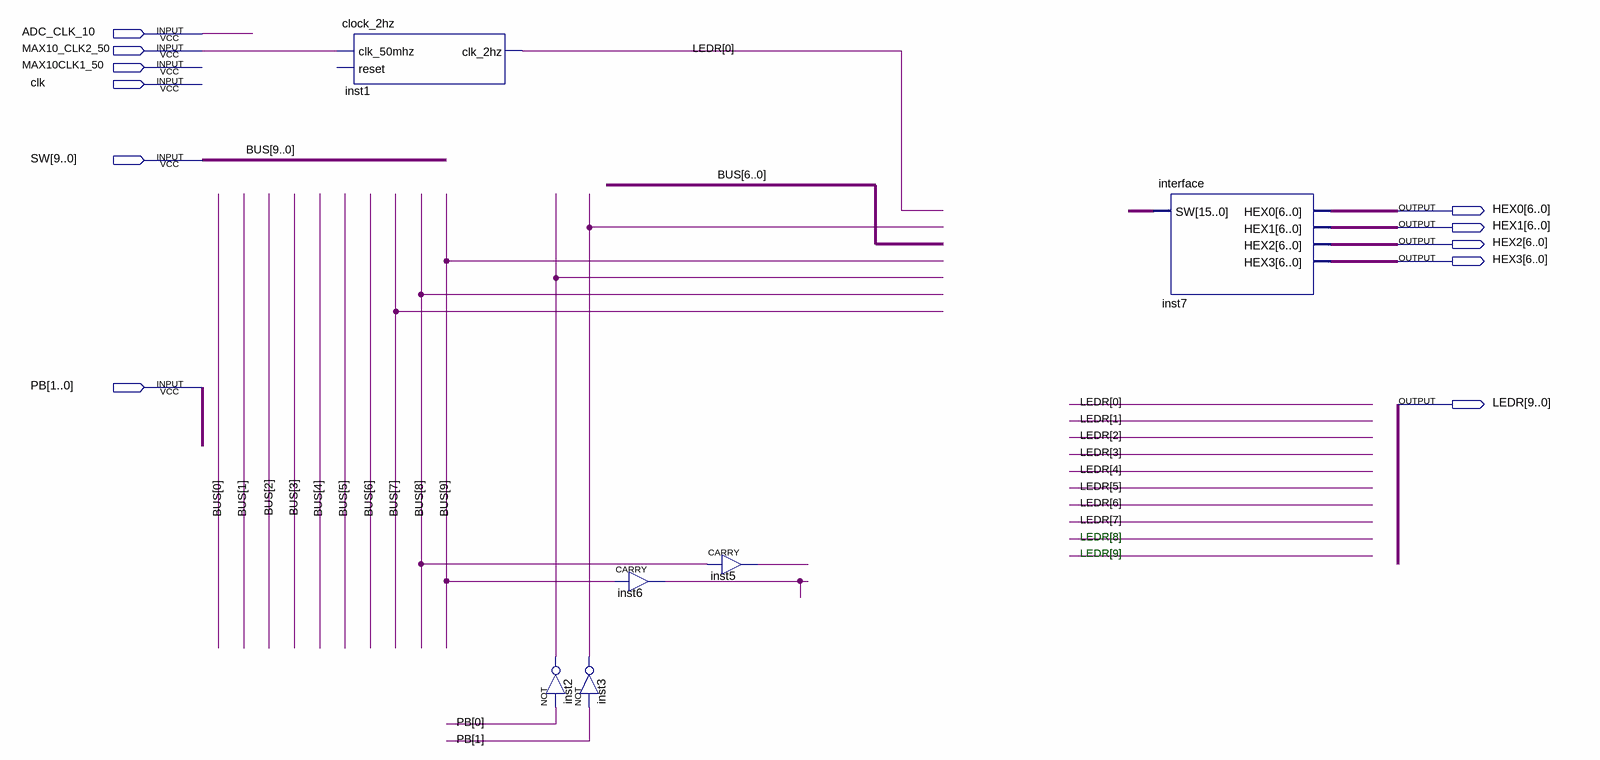
[diagram p0: schematic sheet]
// Quartus schematic testing.bdf as structural Verilog: 6 symbols, 11 pins
module testing (
  input  ADC_CLK_10,
  input  MAX10_CLK2_50,
  input  MAX10CLK1_50,
  input  clk,
  input  [9:0] SW,
  input  [1:0] PB,
  output [6:0] HEX0,
  output [6:0] HEX1,
  output [6:0] HEX2,
  output [6:0] HEX3,
  output [9:0] LEDR
);

  wire inst2_out, inst3_out, inst5_out, inst6_out;
  wire [15:0] undriven;

  clock_2hz inst1 (.clk_50mhz(MAX10_CLK2_50), .clk_2hz(LEDR[0]));  // open: reset
  not inst2 (inst2_out, PB[0]);
  not inst3 (inst3_out, PB[1]);
  CARRY inst6 (.IN(SW[9]), .OUT(inst6_out));
  CARRY inst5 (.IN(SW[8]), .OUT(inst5_out));
  \interface  inst7 (.SW(undriven), .HEX0(HEX0), .HEX1(HEX1), .HEX2(HEX2), .HEX3(HEX3));

  // Other names for the same wires on the sheet: BUS[9:0] = SW

  // Notes on the sheet:
  //   LEDR[8]
  //   LEDR[9]
endmodule
